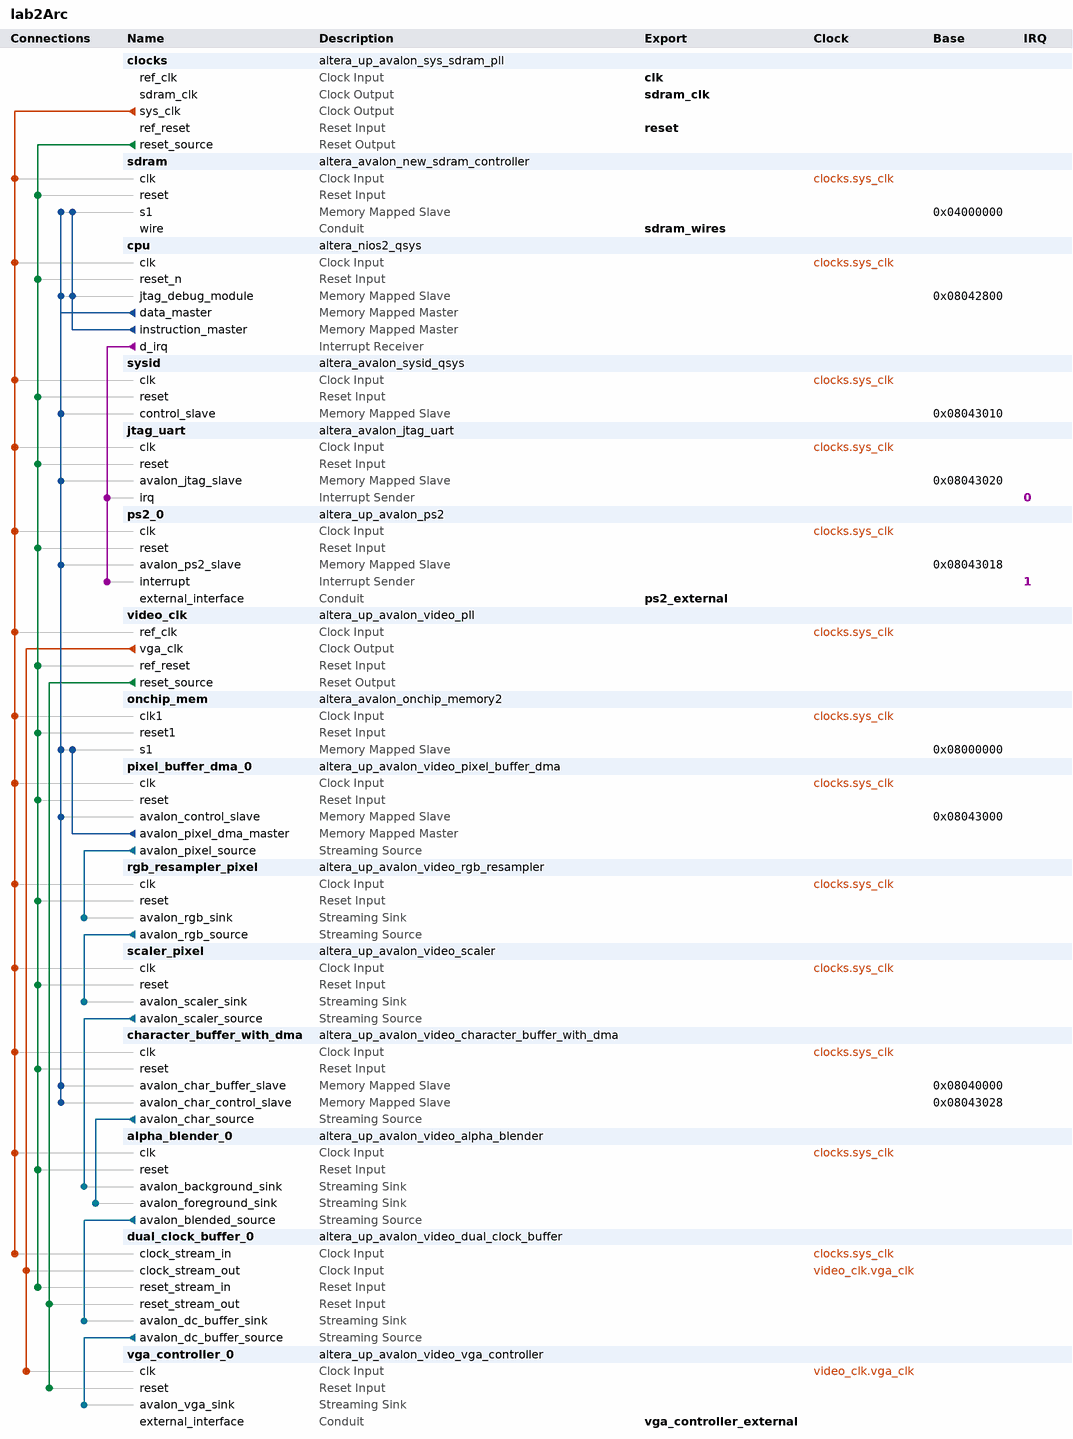
[diagram p0: system contents]
# Platform Designer (Qsys) system lab2Arc, Cyclone V 5CSEMA5F31C6
# Parameters at their usual value, and those the tool derives, are not listed.
package require -exact qsys 18.0
create_system lab2Arc
set_project_property DEVICE_FAMILY {Cyclone V}
set_project_property DEVICE 5CSEMA5F31C6

add_instance clocks altera_up_avalon_sys_sdram_pll 18.0
set_instance_parameter_value clocks CV_boards DE1-SoC
set_instance_parameter_value clocks gui_outclk 50.0
set_instance_parameter_value clocks gui_refclk 50.0

add_instance sdram altera_avalon_new_sdram_controller 18.1
set_instance_parameter_value sdram TAC 5.4
set_instance_parameter_value sdram TRCD 15.0
set_instance_parameter_value sdram TRP 15.0
set_instance_parameter_value sdram casLatency 3
set_instance_parameter_value sdram columnWidth 10
set_instance_parameter_value sdram dataWidth 16
set_instance_parameter_value sdram generateSimulationModel false
set_instance_parameter_value sdram model single_Micron_MT48LC4M32B2_7_chip
set_instance_parameter_value sdram numberOfBanks 4
set_instance_parameter_value sdram numberOfChipSelects 1
set_instance_parameter_value sdram powerUpDelay 100.0
set_instance_parameter_value sdram refreshPeriod 7.8125
set_instance_parameter_value sdram rowWidth 13

add_instance cpu altera_nios2_qsys 16.1
set_instance_parameter_value cpu breakSlave cpu.jtag_debug_module
set_instance_parameter_value cpu exceptionSlave sdram.s1
set_instance_parameter_value cpu icache_size 4096
set_instance_parameter_value cpu impl Tiny
set_instance_parameter_value cpu mmu_TLBMissExcSlave None
set_instance_parameter_value cpu resetSlave sdram.s1
set_instance_parameter_value cpu resetrequest_enabled true

add_instance sysid altera_avalon_sysid_qsys 18.1
set_instance_parameter_value sysid id -559038801

add_instance jtag_uart altera_avalon_jtag_uart 18.1
set_instance_parameter_value jtag_uart simInteractiveOptions NO_INTERACTIVE_WINDOWS

add_instance ps2_0 altera_up_avalon_ps2 18.0

add_instance video_clk altera_up_avalon_video_pll 18.0
set_instance_parameter_value video_clk camera {5MP Digital Camera (THDB_D5M)}
set_instance_parameter_value video_clk gui_refclk 50.0
set_instance_parameter_value video_clk lcd {7" LCD on VEEK-MT and MTL/MTL2 Modules}

add_instance onchip_mem altera_avalon_onchip_memory2 18.1
set_instance_parameter_value onchip_mem dataWidth 32
set_instance_parameter_value onchip_mem dualPort false
set_instance_parameter_value onchip_mem initMemContent true
set_instance_parameter_value onchip_mem initializationFileName onchip_mem.hex
set_instance_parameter_value onchip_mem memorySize 262144

add_instance pixel_buffer_dma_0 altera_up_avalon_video_pixel_buffer_dma 18.0
set_instance_parameter_value pixel_buffer_dma_0 addr_mode X-Y
set_instance_parameter_value pixel_buffer_dma_0 back_start_address 0
set_instance_parameter_value pixel_buffer_dma_0 color_space {8-bit RGB}
set_instance_parameter_value pixel_buffer_dma_0 image_height 240
set_instance_parameter_value pixel_buffer_dma_0 image_width 320
set_instance_parameter_value pixel_buffer_dma_0 start_address 0

add_instance rgb_resampler_pixel altera_up_avalon_video_rgb_resampler 18.0
set_instance_parameter_value rgb_resampler_pixel alpha 1023
set_instance_parameter_value rgb_resampler_pixel input_type {8-bit RGB}
set_instance_parameter_value rgb_resampler_pixel output_type {30-bit RGB}

add_instance scaler_pixel altera_up_avalon_video_scaler 18.0
set_instance_parameter_value scaler_pixel color_bits 10
set_instance_parameter_value scaler_pixel color_planes 3
set_instance_parameter_value scaler_pixel height_scaling 2
set_instance_parameter_value scaler_pixel width_in 320
set_instance_parameter_value scaler_pixel width_scaling 2

add_instance character_buffer_with_dma altera_up_avalon_video_character_buffer_with_dma 18.0
set_instance_parameter_value character_buffer_with_dma enable_transparency true

add_instance alpha_blender_0 altera_up_avalon_video_alpha_blender 18.0

add_instance dual_clock_buffer_0 altera_up_avalon_video_dual_clock_buffer 18.0
set_instance_parameter_value dual_clock_buffer_0 color_bits 10

add_instance vga_controller_0 altera_up_avalon_video_vga_controller 18.0
set_instance_parameter_value vga_controller_0 board DE1-SoC
set_instance_parameter_value vga_controller_0 resolution {VGA 640x480}

# connections
add_connection clocks.sys_clk alpha_blender_0.clk clock
add_connection clocks.sys_clk character_buffer_with_dma.clk clock
add_connection clocks.sys_clk cpu.clk clock
add_connection clocks.sys_clk dual_clock_buffer_0.clock_stream_in clock
add_connection clocks.sys_clk jtag_uart.clk clock
add_connection clocks.sys_clk onchip_mem.clk1 clock
add_connection clocks.sys_clk pixel_buffer_dma_0.clk clock
add_connection clocks.sys_clk ps2_0.clk clock
add_connection clocks.sys_clk rgb_resampler_pixel.clk clock
add_connection clocks.sys_clk scaler_pixel.clk clock
add_connection clocks.sys_clk sdram.clk clock
add_connection clocks.sys_clk sysid.clk clock
add_connection clocks.sys_clk video_clk.ref_clk clock
add_connection video_clk.vga_clk dual_clock_buffer_0.clock_stream_out clock
add_connection video_clk.vga_clk vga_controller_0.clk clock
add_connection clocks.reset_source alpha_blender_0.reset reset
add_connection clocks.reset_source character_buffer_with_dma.reset reset
add_connection clocks.reset_source cpu.reset_n reset
add_connection clocks.reset_source dual_clock_buffer_0.reset_stream_in reset
add_connection clocks.reset_source jtag_uart.reset reset
add_connection clocks.reset_source onchip_mem.reset1 reset
add_connection clocks.reset_source pixel_buffer_dma_0.reset reset
add_connection clocks.reset_source ps2_0.reset reset
add_connection clocks.reset_source rgb_resampler_pixel.reset reset
add_connection clocks.reset_source scaler_pixel.reset reset
add_connection clocks.reset_source sdram.reset reset
add_connection clocks.reset_source sysid.reset reset
add_connection clocks.reset_source video_clk.ref_reset reset
add_connection video_clk.reset_source dual_clock_buffer_0.reset_stream_out reset
add_connection video_clk.reset_source vga_controller_0.reset reset
add_connection cpu.data_master character_buffer_with_dma.avalon_char_buffer_slave avalon
set_connection_parameter_value cpu.data_master/character_buffer_with_dma.avalon_char_buffer_slave baseAddress 0x08040000
add_connection cpu.data_master character_buffer_with_dma.avalon_char_control_slave avalon
set_connection_parameter_value cpu.data_master/character_buffer_with_dma.avalon_char_control_slave baseAddress 0x08043028
add_connection cpu.data_master cpu.jtag_debug_module avalon
set_connection_parameter_value cpu.data_master/cpu.jtag_debug_module baseAddress 0x08042800
add_connection cpu.data_master jtag_uart.avalon_jtag_slave avalon
set_connection_parameter_value cpu.data_master/jtag_uart.avalon_jtag_slave baseAddress 0x08043020
add_connection cpu.data_master onchip_mem.s1 avalon
set_connection_parameter_value cpu.data_master/onchip_mem.s1 baseAddress 0x08000000
add_connection cpu.data_master pixel_buffer_dma_0.avalon_control_slave avalon
set_connection_parameter_value cpu.data_master/pixel_buffer_dma_0.avalon_control_slave baseAddress 0x08043000
add_connection cpu.data_master ps2_0.avalon_ps2_slave avalon
set_connection_parameter_value cpu.data_master/ps2_0.avalon_ps2_slave baseAddress 0x08043018
add_connection cpu.data_master sdram.s1 avalon
set_connection_parameter_value cpu.data_master/sdram.s1 baseAddress 0x04000000
add_connection cpu.data_master sysid.control_slave avalon
set_connection_parameter_value cpu.data_master/sysid.control_slave baseAddress 0x08043010
add_connection cpu.instruction_master cpu.jtag_debug_module avalon
set_connection_parameter_value cpu.instruction_master/cpu.jtag_debug_module baseAddress 0x08042800
add_connection cpu.instruction_master sdram.s1 avalon
set_connection_parameter_value cpu.instruction_master/sdram.s1 baseAddress 0x04000000
add_connection pixel_buffer_dma_0.avalon_pixel_dma_master onchip_mem.s1 avalon
set_connection_parameter_value pixel_buffer_dma_0.avalon_pixel_dma_master/onchip_mem.s1 baseAddress 0x08000000
add_connection alpha_blender_0.avalon_blended_source dual_clock_buffer_0.avalon_dc_buffer_sink avalon_streaming
add_connection character_buffer_with_dma.avalon_char_source alpha_blender_0.avalon_foreground_sink avalon_streaming
add_connection dual_clock_buffer_0.avalon_dc_buffer_source vga_controller_0.avalon_vga_sink avalon_streaming
add_connection pixel_buffer_dma_0.avalon_pixel_source rgb_resampler_pixel.avalon_rgb_sink avalon_streaming
add_connection rgb_resampler_pixel.avalon_rgb_source scaler_pixel.avalon_scaler_sink avalon_streaming
add_connection scaler_pixel.avalon_scaler_source alpha_blender_0.avalon_background_sink avalon_streaming
add_connection cpu.d_irq jtag_uart.irq interrupt
set_connection_parameter_value cpu.d_irq/jtag_uart.irq irqNumber 0
add_connection cpu.d_irq ps2_0.interrupt interrupt
set_connection_parameter_value cpu.d_irq/ps2_0.interrupt irqNumber 1

# exported interfaces
add_interface clk clock sink
set_interface_property clk EXPORT_OF clocks.ref_clk
add_interface ps2_external conduit end
set_interface_property ps2_external EXPORT_OF ps2_0.external_interface
add_interface reset reset sink
set_interface_property reset EXPORT_OF clocks.ref_reset
add_interface sdram_clk clock source
set_interface_property sdram_clk EXPORT_OF clocks.sdram_clk
add_interface sdram_wires conduit end
set_interface_property sdram_wires EXPORT_OF sdram.wire
add_interface vga_controller_external conduit end
set_interface_property vga_controller_external EXPORT_OF vga_controller_0.external_interface

set_interconnect_requirement {$system} qsys_mm.clockCrossingAdapter HANDSHAKE
set_interconnect_requirement {$system} qsys_mm.enableEccProtection FALSE
set_interconnect_requirement {$system} qsys_mm.insertDefaultSlave FALSE
set_interconnect_requirement {$system} qsys_mm.maxAdditionalLatency 1

save_system lab2Arc.qsys
